# Altium schematic sheet MCU.SchDoc
size A3; SheetNumber: 9; SheetTotal: 9
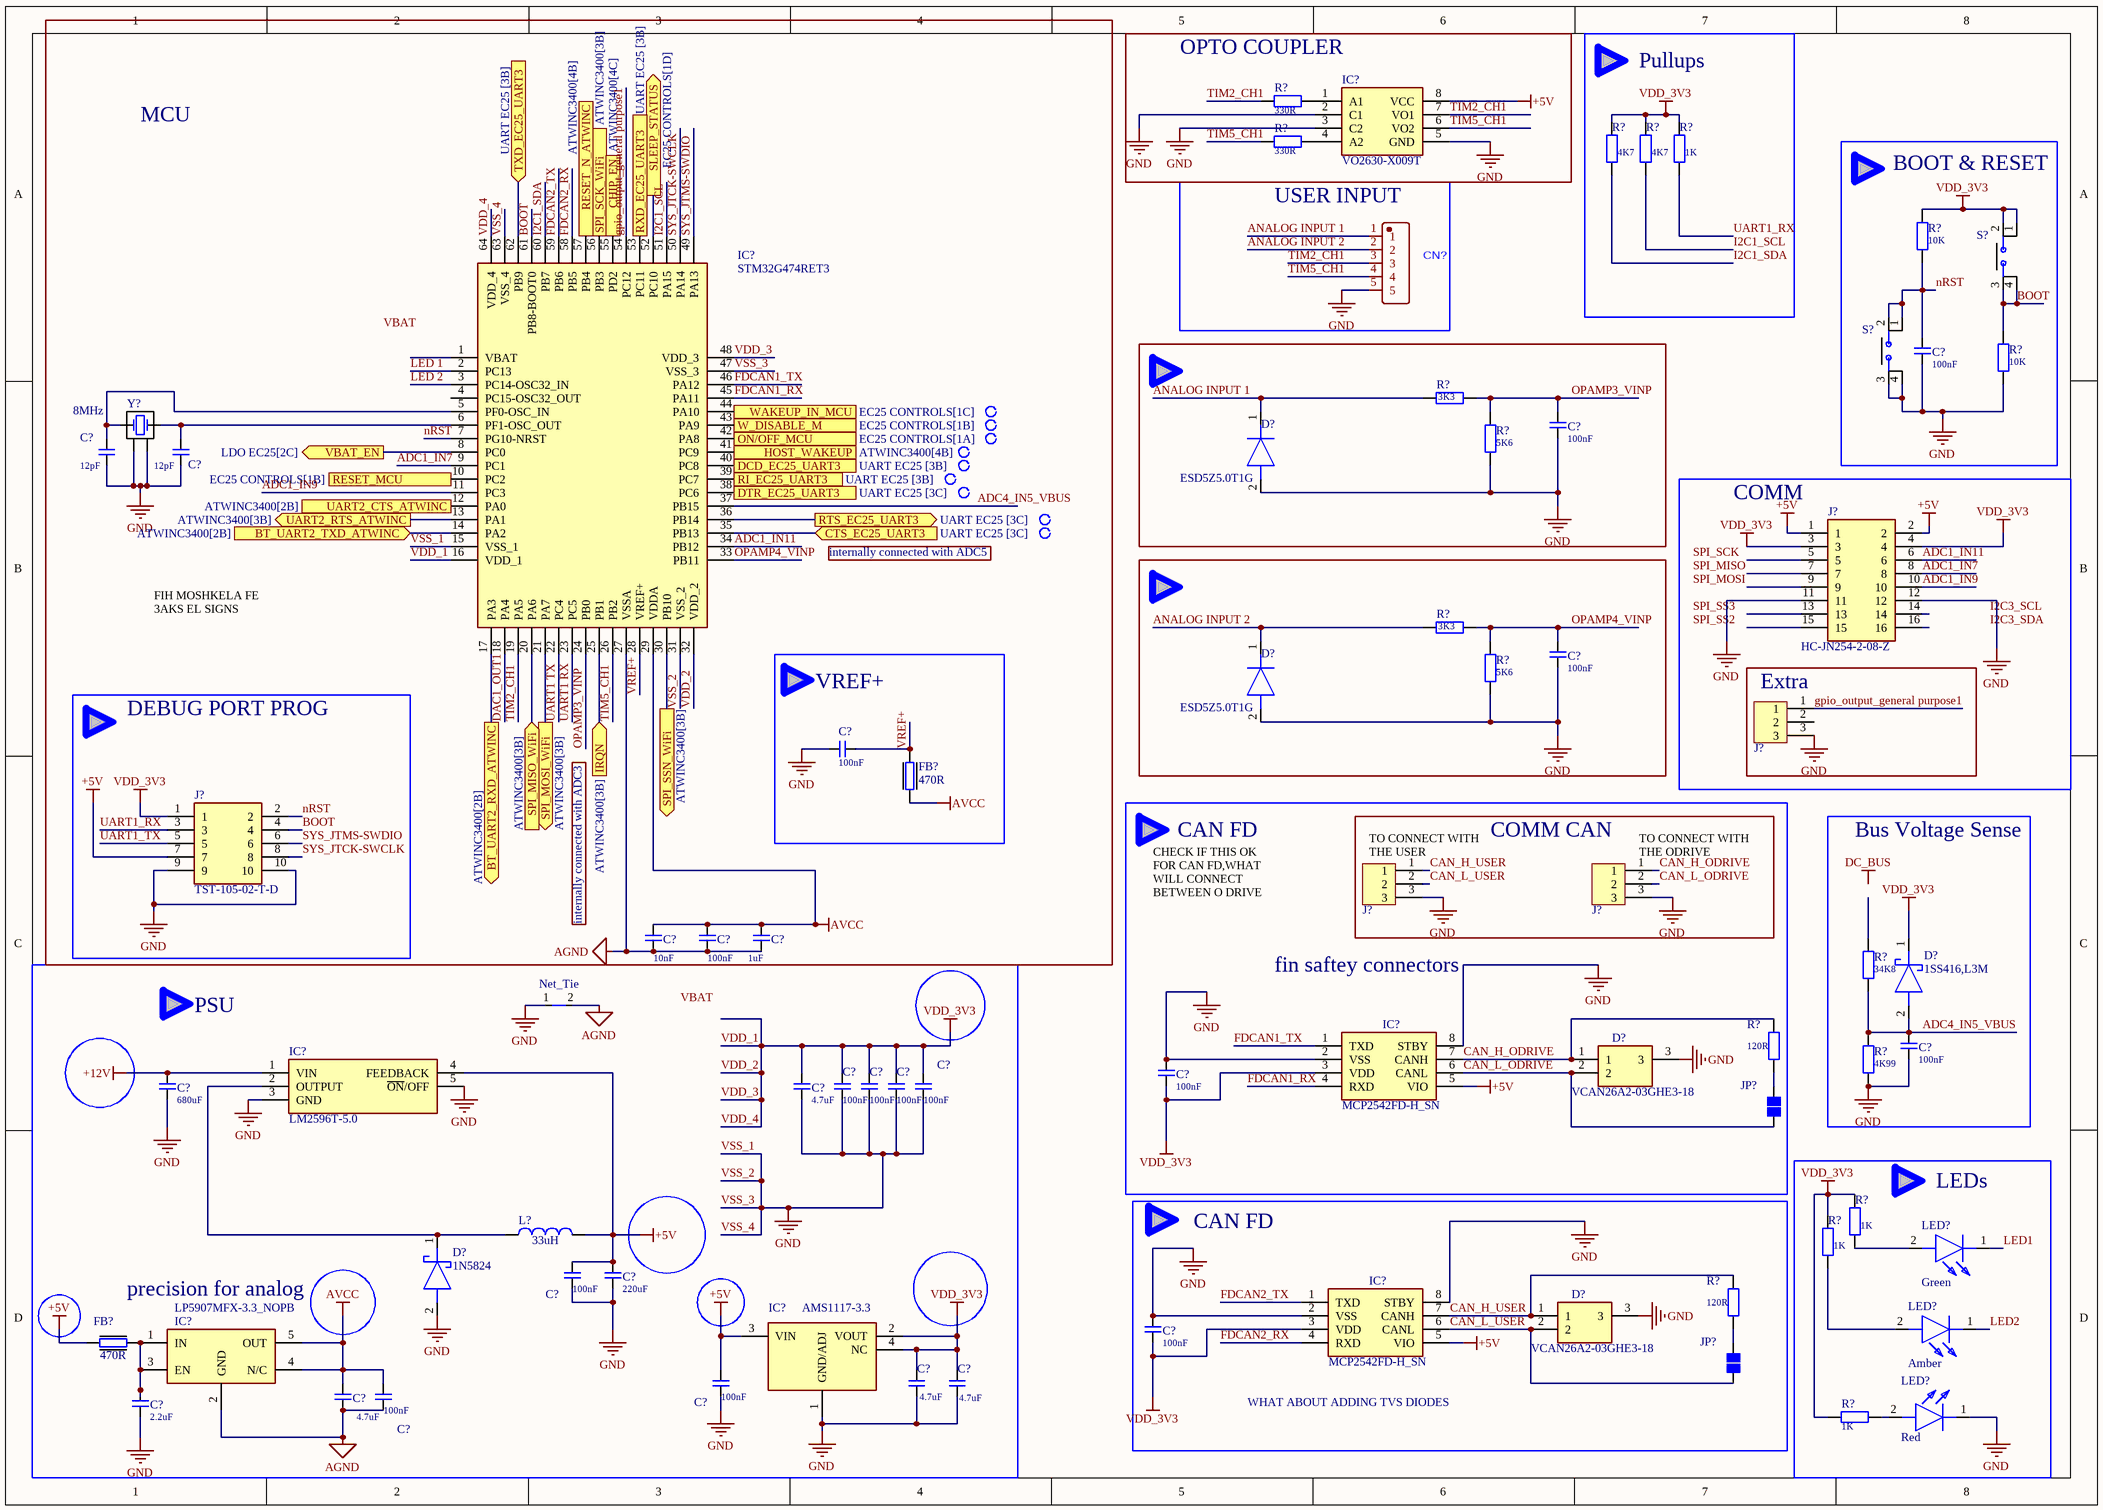
[diagram p0: MCU.SchDoc]

## Parts
(Parts that share a designator on the sheet are numbered #1, #2 ... from top to bottom, then left to right.)
C?#1  value 100nF  [CAPC1005X06N]  (hidden comment: Cap)
C?#2  value 100nF  [CAPC1005X06N]  (hidden comment: Cap)
C?#3  value 12pF  [CAPC1005X06N]  (hidden comment: Cap)
C?#4  value 12pF  [CAPC1005X06N]  (hidden comment: Cap)
C?#5  value 100nF  [CAPC1005X06N]  (hidden comment: Cap)
C?#6  value 100nF  [CAPC1005X06N]  (hidden comment: Cap)
C?#7  value 10nF  [CAPC1005X06N]  (hidden comment: Cap)
C?#8  value 100nF  [CAPC1005X06N]  (hidden comment: Cap)
C?#9  value 1uF  [CAPC1005X06N]  (hidden comment: Cap)
C?#10  value 100nF  [CAPC1005X06N]  (hidden comment: Cap)
C?#11  value 100nF  [CAPC1005X06N]  (hidden comment: Cap)
C?#12  value 680uF  [CAPC1005X06N]  (hidden comment: Cap)
C?#13  value 4.7uF  [CAPC3225X17N]  (hidden comment: Cap)
C?#14  value 100nF  [CAPC1005X06N]  (hidden comment: Cap)
C?#15  value 100nF  [CAPC1005X06N]  (hidden comment: Cap)
C?#16  value 100nF  [CAPC1005X06N]  (hidden comment: Cap)
C?#17  value 100nF  [CAPC1005X06N]  (hidden comment: Cap)
C?#18  value 100nF  [CAPC1005X06N]  (hidden comment: Cap)
C?#19  value 220uF  [CAPC1005X06N]  (hidden comment: Cap)
C?#20  value 100nF  [CAPC1005X06N]  (hidden comment: Cap)
C?#21  value 100nF  [CAPC1005X06N]  (hidden comment: Cap)
C?#22  value 4.7uF  [CAPC3225X17N]  (hidden comment: Cap)
C?#23  value 4.7uF  [CAPC3225X17N]  (hidden comment: Cap)
C?#24  value 4.7uF  [CAPC3225X17N]  (hidden comment: Cap)
C?#25  value 100nF  [CAPC1005X06N]  (hidden comment: Cap)
C?#26  value 2.2uF  [CAPC1005X06N]  (hidden comment: Cap)
CN?  (no value)  [CONN-TH_BX-XH2.54-5PZZ-Y]
D?#1  ESD5Z5.0T1G  [SODFL1608X70N]
D?#2  ESD5Z5.0T1G  [SODFL1608X70N]
D?#3  1SS416,L3M  [SODFL1006X45N]
D?#4  VCAN26A2-03GHE3-18  [SOT65P230X110-3N]
D?#5  1N5824  [1N5824]
D?#6  VCAN26A2-03GHE3-18  [SOT65P230X110-3N]
FB?#1  value 470R  [BLM18SP221SN1B]  (hidden comment: 470 OHM)
FB?#2  value 470R  [BLM18SP221SN1B]  (hidden comment: 470 OHM)
IC?#1  VO2630-X009T  [VO2630X009T]
IC?#2  STM32G474RET3  [QFP50P1200X1200X160-64N]
IC?#3  MCP2542FD-H_SN  [SOIC127P600X175-8N]
IC?#4  LM2596T-5.0  [TO170P470X1028X2142-5P]
IC?#5  MCP2542FD-H_SN  [SOIC127P600X175-8N]
IC?#6  AMS1117-3.3  [SOT229P700X180-4N]
IC?#7  LP5907MFX-3.3_NOPB  [SOT95P280X145-5N]
J?#1  MPN: HC-JN254-2-08-Z  [SHDR16W64P254_2X8_2794X927X940P]  (hidden comment: TST-108-02-T-D)
J?#2  XH2_54_3p  [XH2.54-3P]  (value not drawn)
J?#3  TST-105-02-T-D  [TST-105-XX-Y-D]
J?#4  XH2_54_3p  [XH2.54-3P]  (value not drawn)
J?#5  XH2_54_3p  [XH2.54-3P]  (value not drawn)
JP?#1  Jumper  [Jumper]  (value not drawn)  (no BOM)
JP?#2  Jumper  [Jumper]  (value not drawn)  (no BOM)
L?  value 33uH  [INDP6060X30N]  (hidden comment: L)
LED?#1  Green  [LEDC1608X80N]
LED?#2  Amber  [LEDC1608X80N]
LED?#3  Red  [LEDC1608X80N]
NT?  Net_Tie  [Net_Tie_SMD]  (net tie, no BOM)
R?#1  value 330R  [RESC1005X04N]  (hidden comment: R)
R?#2  value 330R  [RESC1005X04N]  (hidden comment: R)
R?#3  value 4K7  [RESC1005X04N]  (hidden comment: R)
R?#4  value 4K7  [RESC1005X04N]  (hidden comment: R)
R?#5  value 1K  [RESC1005X04N]  (hidden comment: R)
R?#6  value 10K  [RESC1005X04N]  (hidden comment: R)
R?#7  value 10K  [RESC1005X04N]  (hidden comment: R)
R?#8  value 3K3  [RESC1005X04N]  (hidden comment: R)
R?#9  value 5K6  [RESC1005X04N]  (hidden comment: R)
R?#10  value 3K3  [RESC1005X04N]  (hidden comment: R)
R?#11  value 5K6  [RESC1005X04N]  (hidden comment: R)
R?#12  value 34K8  [RESC1005X04N]  (hidden comment: R)
R?#13  value 120R  [RESC3216X06N]  (hidden comment: R)
R?#14  value 4K99  [RESC1005X04N]  (hidden comment: R)
R?#15  value 1K  [RESC1005X04N]  (hidden comment: R)
R?#16  value 1K  [RESC1005X04N]  (hidden comment: R)
R?#17  value 120R  [RESC3216X06N]  (hidden comment: R)
R?#18  value 1K  [RESC1005X04N]  (hidden comment: R)
S?#1  TS18-5-25-SL-260-SMT-TR  [TS18525SL260SMTTR]  (value not drawn)
S?#2  TS18-5-25-SL-260-SMT-TR  [TS18525SL260SMTTR]  (value not drawn)
Y?  value 8MHz  [830105863709]

## Blocks framed on the sheet
MCU: C?#3 C?#4 C?#7-C?#9 IC?#2 Y?
OPTO COUPLER: IC?#1 R?#1 R?#2
Pullups: R?#3-R?#5
BOOT & RESET: C?#1 R?#6 R?#7 S?#1 S?#2
USER INPUT: CN?
COMM: J?#1
VREF+: C?#6 FB?#1
Extra: J?#2
DEBUG PORT PROG: J?#3
COMM CAN: J?#4 J?#5
Bus Voltage Sense: C?#10 D?#3 R?#12 R?#14
CAN FD: C?#20 D?#6 IC?#5 JP?#2 R?#17
LEDs: LED?#1-LED?#3 R?#15 R?#16 R?#18

## Ports
BT_UART2_RXD_ATWINC (out, see ATWINC3400[2B]), BT_UART2_TXD_ATWINC (in, see ATWINC3400[2B]), CHIP_EN (out, see ATWINC3400[4C]), CTS_EC25_UART3 (in, see UART EC25 [3C]), DCD_EC25_UART3 (in, see UART EC25 [3B]), DTR_EC25_UART3 (out, see UART EC25 [3C]), HOST_WAKEUP (out, see ATWINC3400[4B]), IRQN (in, see ATWINC3400[3B]), ON/OFF_MCU (out, see EC25 CONTROLS[1A]), RESET_MCU (out, see EC25 CONTROLS[1B]), RESET_N_ATWINC (out, see ATWINC3400[4B]), RI_EC25_UART3 (in, see UART EC25 [3B]), RTS_EC25_UART3 (out, see UART EC25 [3C]), RXD_EC25_UART3 (out, see UART EC25 [3B]), SLEEP_STATUS (out, see EC25 CONTROLS[1D]), SPI_MISO_WiFi (in, see ATWINC3400[3B]), SPI_MOSI_WiFi (out, see ATWINC3400[3B]), SPI_SCK_WiFi (out, see ATWINC3400[3B]), SPI_SSN_WiFi (out, see ATWINC3400[3B]), TXD_EC25_UART3 (in, see UART EC25 [3B]), UART2_CTS_ATWINC (in, see ATWINC3400[2B]), UART2_RTS_ATWINC (out, see ATWINC3400[3B]), VBAT_EN (out, see LDO EC25[2C]), W_DISABLE_M (out, see EC25 CONTROLS[1B]), WAKEUP_IN_MCU (out, see EC25 CONTROLS[1C])

## Nets
+5V: C?#18.2 C?#19.2 C?#21.2 FB?#2.1 IC?#1.8(VCC) IC?#3.5(VIO) IC?#4.4(FEEDBACK) IC?#5.5(VIO) IC?#6.3(VIN) J?#1.1 J?#1.2 J?#3.7 L?.2
+12V: C?#12.2 IC?#4.1(VIN)
AGND: C?#7.2 C?#8.1 C?#9.2 C?#24.1 C?#25.1 IC?#2.27(VSSA) IC?#7.2(GND) NT?.2
AVCC: C?#7.1 C?#8.2 C?#9.1 C?#24.2 C?#25.2 FB?#1.1 IC?#2.29(VDDA) IC?#7.4(N/C) IC?#7.5(OUT)
VDD_1: C?#11.2 C?#13.2 C?#14.2 C?#15.2 C?#16.2 C?#17.2 C?#20.2 C?#22.2 C?#23.2 D?#3.1(K) IC?#2.16(VDD_1) IC?#2.32(VDD_2) IC?#2.48(VDD_3) IC?#2.64(VDD_4) IC?#3.3(VDD) IC?#5.3(VDD) IC?#6.2(VOUT) IC?#6.4(NC) J?#1.3 J?#1.4 J?#3.1 R?#3.1 R?#4.1 R?#5.1 R?#6.2 R?#15.1 R?#16.1 R?#18.2 S?#1.1(NO_1) S?#1.2(NO_2)  [also labelled VDD_2, VDD_3, VDD_3V3, VDD_4]
VSS_1: C?#1.1 C?#2.1 C?#3.1 C?#4.1 C?#5.1 C?#6.1 C?#10.1 C?#11.1 C?#12.1 C?#13.1 C?#14.1 C?#15.1 C?#16.1 C?#17.1 C?#18.1 C?#19.1 C?#20.1 C?#21.1 C?#22.1 C?#23.1 C?#26.1 CN?.5 D?#1.2(A) D?#2.2(A) D?#4.3 D?#5.2(A) D?#6.3 IC?#1.2(C1) IC?#1.3(C2) IC?#1.5(GND) IC?#2.15(VSS_1) IC?#2.31(VSS_2) IC?#2.47(VSS_3) IC?#2.63(VSS_4) IC?#3.2(VSS) IC?#3.8(STBY) IC?#4.3(GND) IC?#4.5(~{ON}/OFF) IC?#5.2(VSS) IC?#5.8(STBY) IC?#6.1(GND/ADJ) J?#1.11 J?#1.12 J?#2.3 J?#3.9 J?#3.10 J?#4.3 J?#5.3 LED?#3.1(K) NT?.1 R?#7.1 R?#9.2 R?#11.2 R?#14.2 S?#2.3(COM_1) S?#2.4(COM_2) Y?.2(GND_&_LID_1) Y?.4(GND_&_LID_2)  [also labelled GND, VSS_2, VSS_3, VSS_4]
ADC1_IN7: IC?#2.9(PC1) J?#1.8
ADC1_IN9: IC?#2.11(PC3) J?#1.10
ADC1_IN11: IC?#2.34(PB12) J?#1.6
ADC4_IN5_VBUS: C?#10.2 D?#3.2(A) IC?#2.37(PB15) R?#12.2 R?#14.1
ANALOG INPUT 1: CN?.1 D?#1.1(K) R?#8.2
ANALOG INPUT 2: CN?.2 D?#2.1(K) R?#10.2
BOOT: IC?#2.61(PB8-BOOT0) J?#3.4 R?#7.2 S?#1.3(COM_1) S?#1.4(COM_2)
BT_UART2_RXD_ATWINC: IC?#2.17(PA3) ; port BT_UART2_RXD_ATWINC
BT_UART2_TXD_ATWINC: IC?#2.14(PA2) ; port BT_UART2_TXD_ATWINC
CAN_H_ODRIVE: D?#4.1 IC?#3.7(CANH) J?#5.1 R?#13.2
CAN_H_USER: D?#6.1 IC?#5.7(CANH) J?#4.1 R?#17.2
CAN_L_ODRIVE: D?#4.2 IC?#3.6(CANL) J?#5.2 JP?#1.1
CAN_L_USER: D?#6.2 IC?#5.6(CANL) J?#4.2 JP?#2.1
CHIP_EN: IC?#2.55(PD2) ; port CHIP_EN
CTS_EC25_UART3: IC?#2.35(PB13) ; port CTS_EC25_UART3
DAC1_OUT1: IC?#2.18(PA4)
DCD_EC25_UART3: IC?#2.40(PC8) ; port DCD_EC25_UART3
DTR_EC25_UART3: IC?#2.38(PC6) ; port DTR_EC25_UART3
FDCAN1_RX: IC?#2.45(PA11) IC?#3.4(RXD)
FDCAN1_TX: IC?#2.46(PA12) IC?#3.1(TXD)
FDCAN2_RX: IC?#2.58(PB5) IC?#5.4(RXD)
FDCAN2_TX: IC?#2.59(PB6) IC?#5.1(TXD)
gpio_output_general purpose1: IC?#2.54(PC12) J?#2.1
HOST_WAKEUP: IC?#2.41(PC9) ; port HOST_WAKEUP
I2C1_SCL: IC?#2.51(PA15) R?#4.2
I2C1_SDA: IC?#2.60(PB7) R?#3.2
IRQN: IC?#2.25(PB1) ; port IRQN
LED1: LED?#1.1(K)
LED2: LED?#2.1(K)
LED 1: IC?#2.2(PC13)
LED 2: IC?#2.3(PC14-OSC32_IN)
nRST: C?#1.2 IC?#2.7(PG10-NRST) J?#3.2 R?#6.1 S?#2.1(NO_1) S?#2.2(NO_2)
ON/OFF_MCU: IC?#2.42(PA8) ; port ON/OFF_MCU
OPAMP3_VINP: C?#2.2 IC?#2.24(PB0) R?#8.1 R?#9.1
OPAMP4_VINP: C?#5.2 IC?#2.33(PB11) R?#10.1 R?#11.1
RESET_MCU: IC?#2.10(PC2) ; port RESET_MCU
RESET_N_ATWINC: IC?#2.57(PB4) ; port RESET_N_ATWINC
RI_EC25_UART3: IC?#2.39(PC7) ; port RI_EC25_UART3
RTS_EC25_UART3: IC?#2.36(PB14) ; port RTS_EC25_UART3
RXD_EC25_UART3: IC?#2.53(PC11) ; port RXD_EC25_UART3
SLEEP_STATUS: IC?#2.52(PC10) ; port SLEEP_STATUS
SPI_MISO_WiFi: IC?#2.20(PA6) ; port SPI_MISO_WiFi
SPI_MOSI_WiFi: IC?#2.21(PA7) ; port SPI_MOSI_WiFi
SPI_SCK_WiFi: IC?#2.56(PB3) ; port SPI_SCK_WiFi
SPI_SSN_WiFi: IC?#2.30(PB10) ; port SPI_SSN_WiFi
SYS_JTCK-SWCLK: IC?#2.50(PA14) J?#3.8
SYS_JTMS-SWDIO: IC?#2.49(PA13) J?#3.6
TIM2_CH1: CN?.3 IC?#1.7(VO1) IC?#2.19(PA5) R?#1.1
TIM5_CH1: CN?.4 IC?#1.6(VO2) IC?#2.26(PB2) R?#2.1
TXD_EC25_UART3: IC?#2.62(PB9) ; port TXD_EC25_UART3
UART1 RX: IC?#2.23(PC5)
UART1 TX: IC?#2.22(PC4)
UART1_RX: J?#3.3 R?#5.2
UART1_TX: J?#3.5
UART2_CTS_ATWINC: IC?#2.12(PA0) ; port UART2_CTS_ATWINC
UART2_RTS_ATWINC: IC?#2.13(PA1) ; port UART2_RTS_ATWINC
VBAT_EN: IC?#2.8(PC0) ; port VBAT_EN
VREF+: C?#6.2 FB?#1.2 IC?#2.28(VREF+)
W_DISABLE_M: IC?#2.43(PA9) ; port W_DISABLE_M
WAKEUP_IN_MCU: IC?#2.44(PA10) ; port WAKEUP_IN_MCU
NetC?#3_2: C?#3.2 IC?#2.5(PF0-OSC_IN) Y?.1(CRYSTAL__1)
NetC?#4_2: C?#4.2 IC?#2.6(PF1-OSC_OUT) Y?.3(CRYSTAL__2)
NetC?#26_2: C?#26.2 FB?#2.2 IC?#7.1(IN) IC?#7.3(EN)
NetD?#5_1: D?#5.1(K) IC?#4.2(OUTPUT) L?.1
NetIC?#1_1: IC?#1.1(A1) R?#1.2
NetIC?#1_4: IC?#1.4(A2) R?#2.2
NetJP?#1_2: JP?#1.2 R?#13.1
NetJP?#2_2: JP?#2.2 R?#17.1
NetLED?#1_2: LED?#1.2(A) R?#15.2
NetLED?#2_2: LED?#2.2(A) R?#16.2
NetLED?#3_2: LED?#3.2(A) R?#18.1

Not connected (* = marked no-connect by the designer): IC?#2 1(VBAT) 4(PC15-OSC32_OUT); J?#1 5 7 9 13 14 15 16; J?#2 2; R?#12 1

## Notes on the sheet
- internally connected with ADC5
- FIH MOSHKELA FE 3AKS EL SIGNS
- CAN FD
- (near J?#4) TO CONNECT WITH THE USER
- (near J?#5) TO CONNECT WITH THE ODRIVE
- internally connected with ADC3
- CHECK IF THIS OK FOR CAN FD,WHAT WILL CONNECT BETWEEN O DRIVE AND ALSO THE USER
- fin saftey connectors
- PSU
- precision for analog
- WHAT ABOUT ADDING TVS DIODES
- Labels drawn without touching a wire or pin: DC_BUS, I2C3_SCL, I2C3_SDA, SPI_MISO, SPI_MOSI, SPI_SCK, SPI_SS2, SPI_SS3, VBAT

## Library data of the parts
C?#1 C?#2 C?#5 C?#6 C?#8 C?#10 C?#11 C?#14-C?#18 C?#20 C?#21 C?#25 = Cap: Capacitor; MPN: GCM155R71H104KE02D; Link: https://jlcpcb.com/partdetail/MurataElectronics-GCM155R71H104KE02D/C85858; Price: 0.0031
C?#3 C?#4 = Cap: Capacitor; MPN: GRM1555C1H120JA01D; Link: https://jlcpcb.com/partdetail/MurataElectronics-GRM1555C1H120JA01D/C76948; Price: 0.0028
C?#7 C?#12 C?#19 = Cap: Capacitor
C?#9 = Cap: Capacitor; MPN: GRM155Z71A105KE01D; Link: https://jlcpcb.com/partdetail/548880-GRM155Z71A105KE01D/C528974; Price: 0.0206
C?#13 C?#22-C?#24 = Cap: Capacitor; MPN: CC1210KKX7R8BB475; Link: https://www.lcsc.com/product-detail/Multilayer-Ceramic-Capacitors-MLCC-SMD-SMT_YAGEO-CC1210KKX7R8BB475_C2980104.html; Price: 0.1519
C?#26 = Cap: Capacitor; MPN: GRM155Z71A225KE44D; Link: https://jlcpcb.com/partdetail/3478404-GRM155Z71A225KE44D/C2999759; Price: 0.0332
CN? = BX-XH2.54-5PZZ-Y COPY
D?#1 D?#2 = ESD5Z5.0T1G: Diode; Manufacturer_Name: onsemi; Datasheet Link: http://www.onsemi.com/pub/Collateral/ESD5Z2.5T1-D.PDF; Height: 0.7mm; Mouser Part Number: 863-ESD5Z5.0T1G; Mouser Price/Stock: https://www.mouser.co.uk/ProductDetail/onsemi/ESD5Z5.0T1G?qs=OSf9jACorvYw3fDx1S8P6A%3D%3D; Arrow Part Number: ESD5Z5.0T1G; Arrow Price/Stock: https://www.arrow.com/en/products/esd5z5.0t1g/on-semiconductor?utm_currency=USD&region=nac; MPN: ESD5Z5.0T1G; link: https://www.lcsc.com/product-detail/ESD-and-Surge-Protection-TVS-ESD_BORN-ESD5Z5-0T1G_C343989.html?s_z=n_ESD5Z5.0T1G
D?#3 = 1SS416,L3M: Schottky Diode; Manufacturer_Name: Toshiba; MPN: 1SS416,L3M(B; Datasheet Link: http://toshiba.semicon-storage.com/info/docget.jsp?did=344&prodName=1SS416; Height: 0.45mm; Mouser Part Number: 757-1SS416L3M; Mouser Price/Stock: https://www.mouser.co.uk/ProductDetail/Toshiba/1SS416L3M?qs=G9o9YCnxvoYU%252BWabcXJZJg%3D%3D; Arrow Part Number: 1SS416,L3M; Arrow Price/Stock: https://www.arrow.com/en/products/1ss416l3m/toshiba?region=nac; Link: https://www.lcsc.com/product-detail/Schottky-Diodes_TOSHIBA-1SS416-L3M-B_C2943683.html; Price: 0.0251
D?#4 D?#6 = VCAN26A2-03GHE3-18: TVS Diode (Bi-directional); Manufacturer_Name: Vishay; Datasheet Link: http://www.mouser.com/datasheet/2/427/vcan26a2-03g-748292.pdf; Height: 1.1mm; Manufacturer_Part_Number: VCAN26A2-03GHE3-18; Mouser Part Number: 78-VCAN26A2-03GHE318; Mouser Price/Stock: https://www.mouser.co.uk/ProductDetail/Vishay-Semiconductors/VCAN26A2-03GHE3-18?qs=53vSufdqhLobCHEQZw8sJw%3D%3D
D?#5 = 1N5824: Schottky Diode; Manufacturer_Name: Microchip; Datasheet Link: https://www.microsemi.com/document-portal/doc_download/5865-1n5823-25-datasheet; Height: 11.43mm; Manufacturer_Part_Number: 1N5824; Mouser Part Number: 494-1N5824; Mouser Price/Stock: https://www.mouser.co.uk/ProductDetail/Microchip-Technology/1N5824?qs=TXMzd3F6EyleEEWqakQxJw%3D%3D; Arrow Part Number: 1N5824; Arrow Price/Stock: https://www.arrow.com/en/products/1n5824/microchip-technology?utm_currency=USD&region=nac
FB?#1 FB?#2 = BLM18KG471SN1D: Ferrite Bead; Manufacturer_Name: Murata Electronics; Datasheet Link: http://www.murata.com/~/media/webrenewal/support/library/catalog/products/emc/emifil/c31e.ashx?la=en-gb; Height: 0.95mm; MPN: BLM18KG471SN1D; Mouser Part Number: 81-BLM18KG471SN1D; Mouser Price/Stock: https://www.mouser.co.uk/ProductDetail/Murata-Electronics/BLM18KG471SN1D?qs=rvfpa0%252BU10NIg0zs9veElg%3D%3D; Arrow Part Number: BLM18KG471SN1D; Arrow Price/Stock: https://www.arrow.com/en/products/blm18kg471sn1d/murata-manufacturing?region=europe; Link: https://www.lcsc.com/product-detail/Ferrite-Beads_Murata-Electronics-BLM18KG471SN1D_C413961.html
IC?#1 = VO2630-X009T: Integrated Circuit; Manufacturer_Name: Vishay; Datasheet Link: https://componentsearchengine.com/Datasheets/1/VO2630-X009T.pdf; Height: 4.01mm; Manufacturer_Part_Number: VO2630-X009T; Mouser Part Number: 78-VO2630-X009T; Mouser Price/Stock: https://www.mouser.co.uk/ProductDetail/Vishay-Semiconductors/VO2630-X009T?qs=5csRq1wdUj4uarriRg0CFA%3D%3D; Arrow Part Number: VO2630-X009T; Arrow Price/Stock: https://www.arrow.com/en/products/vo2630-x009t/vishay?region=nac
IC?#2 = STM32G474RET3: Integrated Circuit; Manufacturer_Name: STMicroelectronics; Datasheet Link: https://www.st.com/resource/en/datasheet/stm32g474re.pdf; Height: 1.6mm; Manufacturer_Part_Number: STM32G474RET3; Mouser Part Number: 511-STM32G474RET3; Mouser Price/Stock: https://www.mouser.co.uk/ProductDetail/STMicroelectronics/STM32G474RET3?qs=xZ%2FP%252Ba9zWqYL6K%252Ba4ZBwGg%3D%3D; Arrow Part Number: STM32G474RET3; Arrow Price/Stock: https://www.arrow.com/en/products/stm32g474ret3/stmicroelectronics?utm_currency=USD&region=nac
IC?#3 IC?#5 = MCP2542FD-H_SN: Integrated Circuit; Manufacturer_Name: Microchip; Manufacturer_Part_Number: MCP2542FD-H/SN; Datasheet Link: http://ww1.microchip.com/downloads/en/devicedoc/20005514a.pdf; Height: 1.75mm; Mouser Part Number: 579-MCP2542FD-H/SN; Mouser Price/Stock: https://www.mouser.co.uk/ProductDetail/Microchip-Technology/MCP2542FD-H-SN?qs=qdgZG5p0FZ4YwT%252BnBHAU%252BQ%3D%3D; Arrow Part Number: MCP2542FD-H/SN; Arrow Price/Stock: https://www.arrow.com/en/products/mcp2542fd-hsn/microchip-technology?region=nac
IC?#4 = LM2596T-5.0: Integrated Circuit; Manufacturer_Name: Texas Instruments; Datasheet Link: http://www.ti.com/general/docs/lit/getliterature.tsp?genericPartNumber=lm2596&fileType=pdf; Height: 4.7mm; Manufacturer_Part_Number: LM2596T-5.0; Mouser Part Number: 926-LM2596T-50; Mouser Price/Stock: https://www.mouser.co.uk/ProductDetail/Texas-Instruments/LM2596T-5.0?qs=X1J7HmVL2ZHGhhjJIS7EQw%3D%3D; Arrow Part Number: LM2596T-5.0; Arrow Price/Stock: null?region=nac
IC?#6 = AMS1117-3.3: Integrated Circuit; Manufacturer_Name: Advanced; Datasheet Link: https://datasheet.datasheetarchive.com/originals/distributors/Datasheets-28/DSA-550594.pdf; Height: 1.8mm; MPN: AMS1117-3.3; Link: https://www.lcsc.com/product-detail/Voltage-Regulators-Linear-Low-Drop-Out-LDO-Regulators_Advanced-Monolithic-Systems-AMS1117-3-3_C6186.html; Price: 0.1342
IC?#7 = LP5907MFX-3.3_NOPB: Integrated Circuit; Manufacturer_Name: Texas Instruments; MPN: LP5907MFX-3.3/NOPB; Datasheet Link: https://datasheet.datasheetarchive.com/originals/distributors/Datasheets-SFU2/DSASFU100037200.pdf; Height: 1.45mm; Mouser Part Number: 595-LP5907MFX-3.3NPB; Mouser Price/Stock: https://www.mouser.co.uk/ProductDetail/Texas-Instruments/LP5907MFX-3.3-NOPB?qs=biyDIajrTn6NhrJCoL%2FdSQ%3D%3D; Arrow Part Number: LP5907MFX-3.3/NOPB; Arrow Price/Stock: https://www.arrow.com/en/products/lp5907mfx-3.3nopb/texas-instruments?utm_currency=USD&region=nac; Link: https://www.lcsc.com/product-detail/Voltage-Regulators-Linear-Low-Drop-Out-LDO-Regulators_Texas-Instruments-LP5907MFX-3-3-NOPB_C80670.html; Price: 0.1083
J?#1 = TST-108-02-T-D: Connector; Mouser Part Number: 200-TST10802TD; Mouser Price/Stock: https://www.mouser.co.uk/ProductDetail/Samtec/TST-108-02-T-D?qs=rU5fayqh%252BE1iZn2yp3BQ2w%3D%3D; Arrow Part Number: TST-108-02-T-D; Arrow Price/Stock: https://www.arrow.com/en/products/tst-108-02-t-d/samtec?region=nac; Link: https://www.lcsc.com/product-detail/IDC-Connectors_HCTL-HC-JN254-2-08-Z_C5372867.html; Price: 0.0987
J?#2 J?#4 J?#5 = XH2_54_3p: MPN: ZX-XH2.54-3PZZ; Link: https://www.lcsc.com/product-detail/Wire-To-Board-Connector_Megastar-ZX-XH2-54-3PZZ_C7429633.html; Price: 0.0073
J?#3 = TST-105-02-T-D: Connector; Manufacturer_Name: SAMTEC; MPN: ZX-IDC2.54-2-5PZZ; Datasheet Link: http://suddendocs.samtec.com/prints/tst-1xx-xx-x-x-xx-xx-mkt.pdf; Mouser Part Number: 200-TST10502TD; Mouser Price/Stock: https://www.mouser.co.uk/ProductDetail/Samtec/TST-105-02-T-D?qs=rU5fayqh%252BE1w4XXP0IOe8w%3D%3D; Arrow Part Number: TST-105-02-T-D; Arrow Price/Stock: https://www.arrow.com/en/products/tst-105-02-t-d/samtec?region=nac; Link: https://www.lcsc.com/product-detail/IDC-Connectors_Megastar-ZX-IDC2-54-2-5PZZ_C7501191.html?s_z=n_IDC%20Connector; Price: 0.1126
LED?#1 = 150060SS75000: LED; Manufacturer_Name: Wurth Elektronik; MPN: XL-1608UGC-04; Height: 0.8mm; Mouser Part Number: 710-150060SS75000; Mouser Price/Stock: https://www.mouser.co.uk/ProductDetail/Wurth-Elektronik/150060SS75000?qs=LlUlMxKIyB0oQaxwspeTEA%3D%3D; Price: 0.0041; Link: https://www.lcsc.com/product-detail/LED-Indication-Discrete_XINGLIGHT-XL-1608UGC-04_C965804.html
LED?#2 = 150060SS75000: LED; Manufacturer_Name: Wurth Elektronik; MPN: BL-HJC36G-AV-TRB; Height: 0.8mm; Mouser Part Number: 710-150060SS75000; Mouser Price/Stock: https://www.mouser.co.uk/ProductDetail/Wurth-Elektronik/150060SS75000?qs=LlUlMxKIyB0oQaxwspeTEA%3D%3D; Price: 0.; Link: https://www.lcsc.com/product-detail/LED-Indication-Discrete_BrtLed-Bright-LED-Elec-BL-HJC36G-AV-TRB_C165983.html?s_z=n_led%200603
LED?#3 = 150060SS75000: LED; Manufacturer_Name: Wurth Elektronik; MPN: XL-1608SURC-06; Height: 0.8mm; Mouser Part Number: 710-150060SS75000; Mouser Price/Stock: https://www.mouser.co.uk/ProductDetail/Wurth-Elektronik/150060SS75000?qs=LlUlMxKIyB0oQaxwspeTEA%3D%3D; Price: 0.003; Link: https://www.lcsc.com/product-detail/LED-Indication-Discrete_XINGLIGHT-XL-1608SURC-06_C965799.html
NT? = Net_Tie: Net Tie
R?#1 R?#2 = R: Resistor
R?#3 R?#4 = R: Resistor; MPN: RC0402FR-074K7L; Link: https://jlcpcb.com/partdetail/Yageo-RC0402FR074K7L/C105871; Price: 0.0006
R?#5 R?#15 R?#16 R?#18 = R: Resistor; MPN: RC0402FR-071KL; Link: RC0402FR-071KL; Price: 0.0006
R?#6 R?#7 = R: Resistor; MPN: RC0402FR-0710KL; Link: https://jlcpcb.com/partdetail/Yageo-RC0402FR0710KL/C60490; Price: 0.0005
R?#8 R?#10 = R: Resistor; MPN: RC0402FR-073K3L; Link: https://jlcpcb.com/partdetail/Yageo-RC0402FR073K3L/C137992; Price: 0.0006
R?#9 R?#11 = R: Resistor; MPN: RC0402FR-075K6L; Link: https://jlcpcb.com/partdetail/Yageo-RC0402FR075K6L/C163457; Price: 0.0005
R?#12 = R: Resistor; MPN: RC0402FR-0734K8L; Link: https://jlcpcb.com/partdetail/Yageo-RC0402FR0734K8L/C327350; Price: 0.0006
R?#13 R?#17 = R: Resistor; MPN: RC1206FR-07120RL; Link: https://www.lcsc.com/product-detail/Chip-Resistor-Surface-Mount_YAGEO-RC1206FR-07120RL_C114928.html; Price: 0.0036
R?#14 = R: Resistor; MPN: RC0402FR-074K99L; Link: https://jlcpcb.com/partdetail/Yageo-RC0402FR074K99L/C137965; Price: 0.0006
S?#1 S?#2 = TS18-5-25-SL-260-SMT-TR: Switch; Manufacturer_Name: Same Sky; MPN: GT-TC084B-H015-L5; Datasheet Link: https://www.sameskydevices.com/product/resource/supplyframepdf/ts18.pdf; Height: 2.7mm; Mouser Part Number: 179-TS18525SL260SMTT; Mouser Price/Stock: https://www.mouser.co.uk/ProductDetail/Same-Sky/TS18-5-25-SL-260-SMT-TR?qs=tlsG%2FOw5FFh0yS4gYnfcwg%3D%3D; Link: https://www.lcsc.com/product-detail/Tactile-Switches_G-Switch-GT-TC084B-H015-L5_C778173.html; Price: 0.049
Y? = XTAL_3225: Crystal or Oscillator; Manufacturer_Name: Wurth Elektronik; MPN: XL2EL89COI-111YLC-8M; Datasheet Link: https://www.we-online.com/catalog/datasheet/830105863709.pdf; Height: 0.8mm; Mouser Part Number: 710-830105863709; Mouser Price/Stock: https://www.mouser.co.uk/ProductDetail/Wurth-Elektronik/830105863709?qs=hd1VzrDQEGgXVxZIC%252BUALw%3D%3D; Link: https://www.lcsc.com/product-detail/Crystals_YXC-Crystal-Oscillators-XL2EL89COI-111YLC-8M_C2973805.html; Price: 0.115